# Altium project TopBoard.PrjPcb (part 2 of 2)
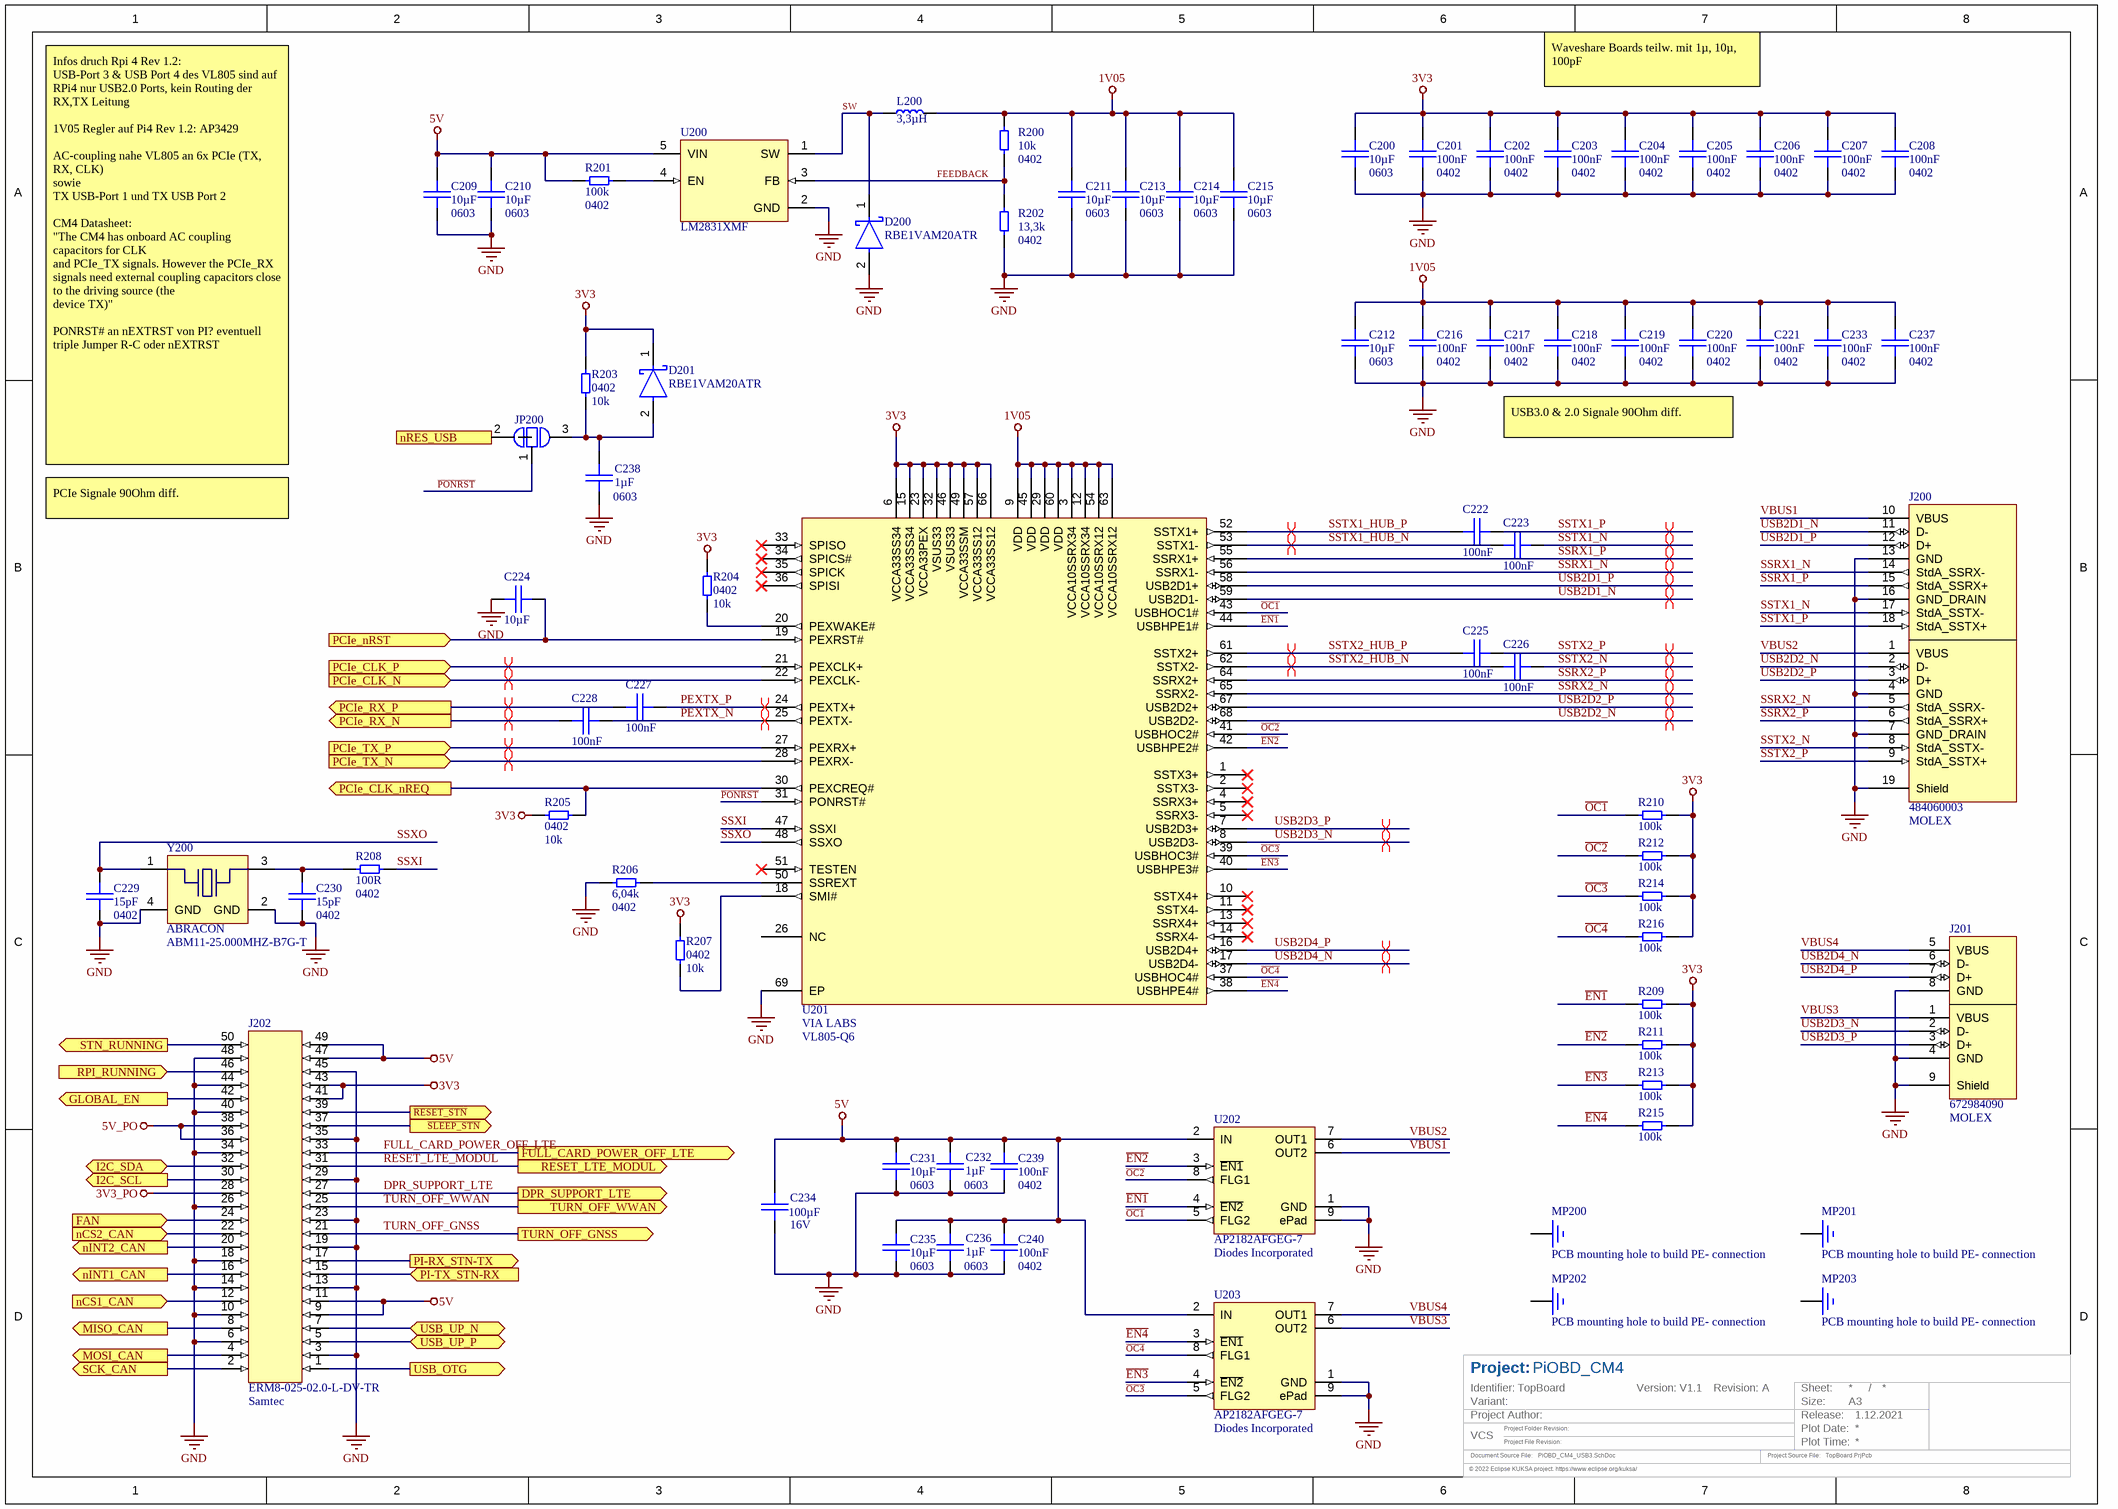
[diagram p2: PiOBD_CM4_USB3.SchDoc]

## Nets that join several sheets
3V3: PiOBD_CM4_Pi (14 pins), PiOBD_CM4_USB3 (32 pins)
3V3_PO: PiOBD_CM4_Pi (C105.2 R107.2 U100.6), PiOBD_CM4_USB3 (J202.28)
5V: PiOBD_CM4_Pi (C103.2 R115.2 U102.1), PiOBD_CM4_USB3 (17 pins)
5V_PO: PiOBD_CM4_Pi (7 pins), PiOBD_CM4_USB3 (J202.36 J202.38)
GND: PiOBD_CM4_Pi (96 pins), PiOBD_CM4_USB3 (70 pins)
~{RESET_STN}: PiOBD_CM4_Pi (P100.34), PiOBD_CM4_USB3 (J202.39)
~{SLEEP_STN}: PiOBD_CM4_Pi (P100.30), PiOBD_CM4_USB3 (J202.37)
DPR_SUPPORT_LTE: PiOBD_CM4_Pi (P100.25 R100.1), PiOBD_CM4_USB3 (J202.27)
FAN: PiOBD_CM4_Pi (P100.41), PiOBD_CM4_USB3 (J202.24)
FULL_CARD_POWER_OFF_LTE: PiOBD_CM4_Pi (P100.29 R102.1), PiOBD_CM4_USB3 (J202.33)
GLOBAL_EN: PiOBD_CM4_Pi (P100.99 P102.12), PiOBD_CM4_USB3 (J202.42)
MISO_CAN: PiOBD_CM4_Pi (P100.40), PiOBD_CM4_USB3 (J202.8)
MOSI_CAN: PiOBD_CM4_Pi (P100.44), PiOBD_CM4_USB3 (J202.4)
nCS1_CAN: PiOBD_CM4_Pi (P100.39), PiOBD_CM4_USB3 (J202.12)
nCS2_CAN: PiOBD_CM4_Pi (P100.37), PiOBD_CM4_USB3 (J202.22)
nINT1_CAN: PiOBD_CM4_Pi (P100.48), PiOBD_CM4_USB3 (J202.16)
nINT2_CAN: PiOBD_CM4_Pi (P100.46), PiOBD_CM4_USB3 (J202.20)
nRES_USB: PiOBD_CM4_Pi (P100.100), PiOBD_CM4_USB3 (JP200.2)
PCIe_CLK_N: PiOBD_CM4_Pi (P100.112), PiOBD_CM4_USB3 (U201.22)
PCIe_CLK_nREQ: PiOBD_CM4_Pi (P100.102), PiOBD_CM4_USB3 (R205.2 U201.30)
PCIe_CLK_P: PiOBD_CM4_Pi (P100.110), PiOBD_CM4_USB3 (U201.21)
PCIe_nRST: PiOBD_CM4_Pi (P100.109), PiOBD_CM4_USB3 (C224.1 U201.19)
PCIe_RX_N: PiOBD_CM4_Pi (P100.118), PiOBD_CM4_USB3 (C228.2)
PCIe_RX_P: PiOBD_CM4_Pi (P100.116), PiOBD_CM4_USB3 (C227.2)
PCIe_TX_N: PiOBD_CM4_Pi (P100.124), PiOBD_CM4_USB3 (U201.28)
PCIe_TX_P: PiOBD_CM4_Pi (P100.122), PiOBD_CM4_USB3 (U201.27)
PI-RX_STN-TX: PiOBD_CM4_Pi (R114.2), PiOBD_CM4_USB3 (J202.17)
PI-TX_STN-RX: PiOBD_CM4_Pi (R113.2), PiOBD_CM4_USB3 (J202.15)
RESET_LTE_MODUL: PiOBD_CM4_Pi (P100.27 R101.1), PiOBD_CM4_USB3 (J202.31)
RPI_RUNNING: PiOBD_CM4_Pi (R107.1 U100.4), PiOBD_CM4_USB3 (J202.46)
SCK_CAN: PiOBD_CM4_Pi (P100.38), PiOBD_CM4_USB3 (J202.2)
SCL0: PiOBD_CM4_Pi (J101.3 P100.80 P101.26 R105.1), PiOBD_CM4_USB3 (J202.30)
SDA0: PiOBD_CM4_Pi (J101.2 P100.82 P101.24 R106.1), PiOBD_CM4_USB3 (J202.32)
STN_RUNNING: PiOBD_CM4_Pi (P100.54), PiOBD_CM4_USB3 (J202.50)
TURN_OFF_GNSS: PiOBD_CM4_Pi (P100.47), PiOBD_CM4_USB3 (J202.21)
TURN_OFF_WWAN: PiOBD_CM4_Pi (P100.26), PiOBD_CM4_USB3 (J202.25)
USB_OTG: PiOBD_CM4_Pi (P100.101), PiOBD_CM4_USB3 (J202.1)
USB_UP_N: PiOBD_CM4_Pi (P100.103), PiOBD_CM4_USB3 (J202.7)
USB_UP_P: PiOBD_CM4_Pi (P100.105), PiOBD_CM4_USB3 (J202.5)

## Assembly variants
BASIC: not fitted R105 R106